# Altium schematic sheet microcontroller_board2.SchDoc
size 580 x 341 mm; SheetNumber: 2; SheetTotal: 2
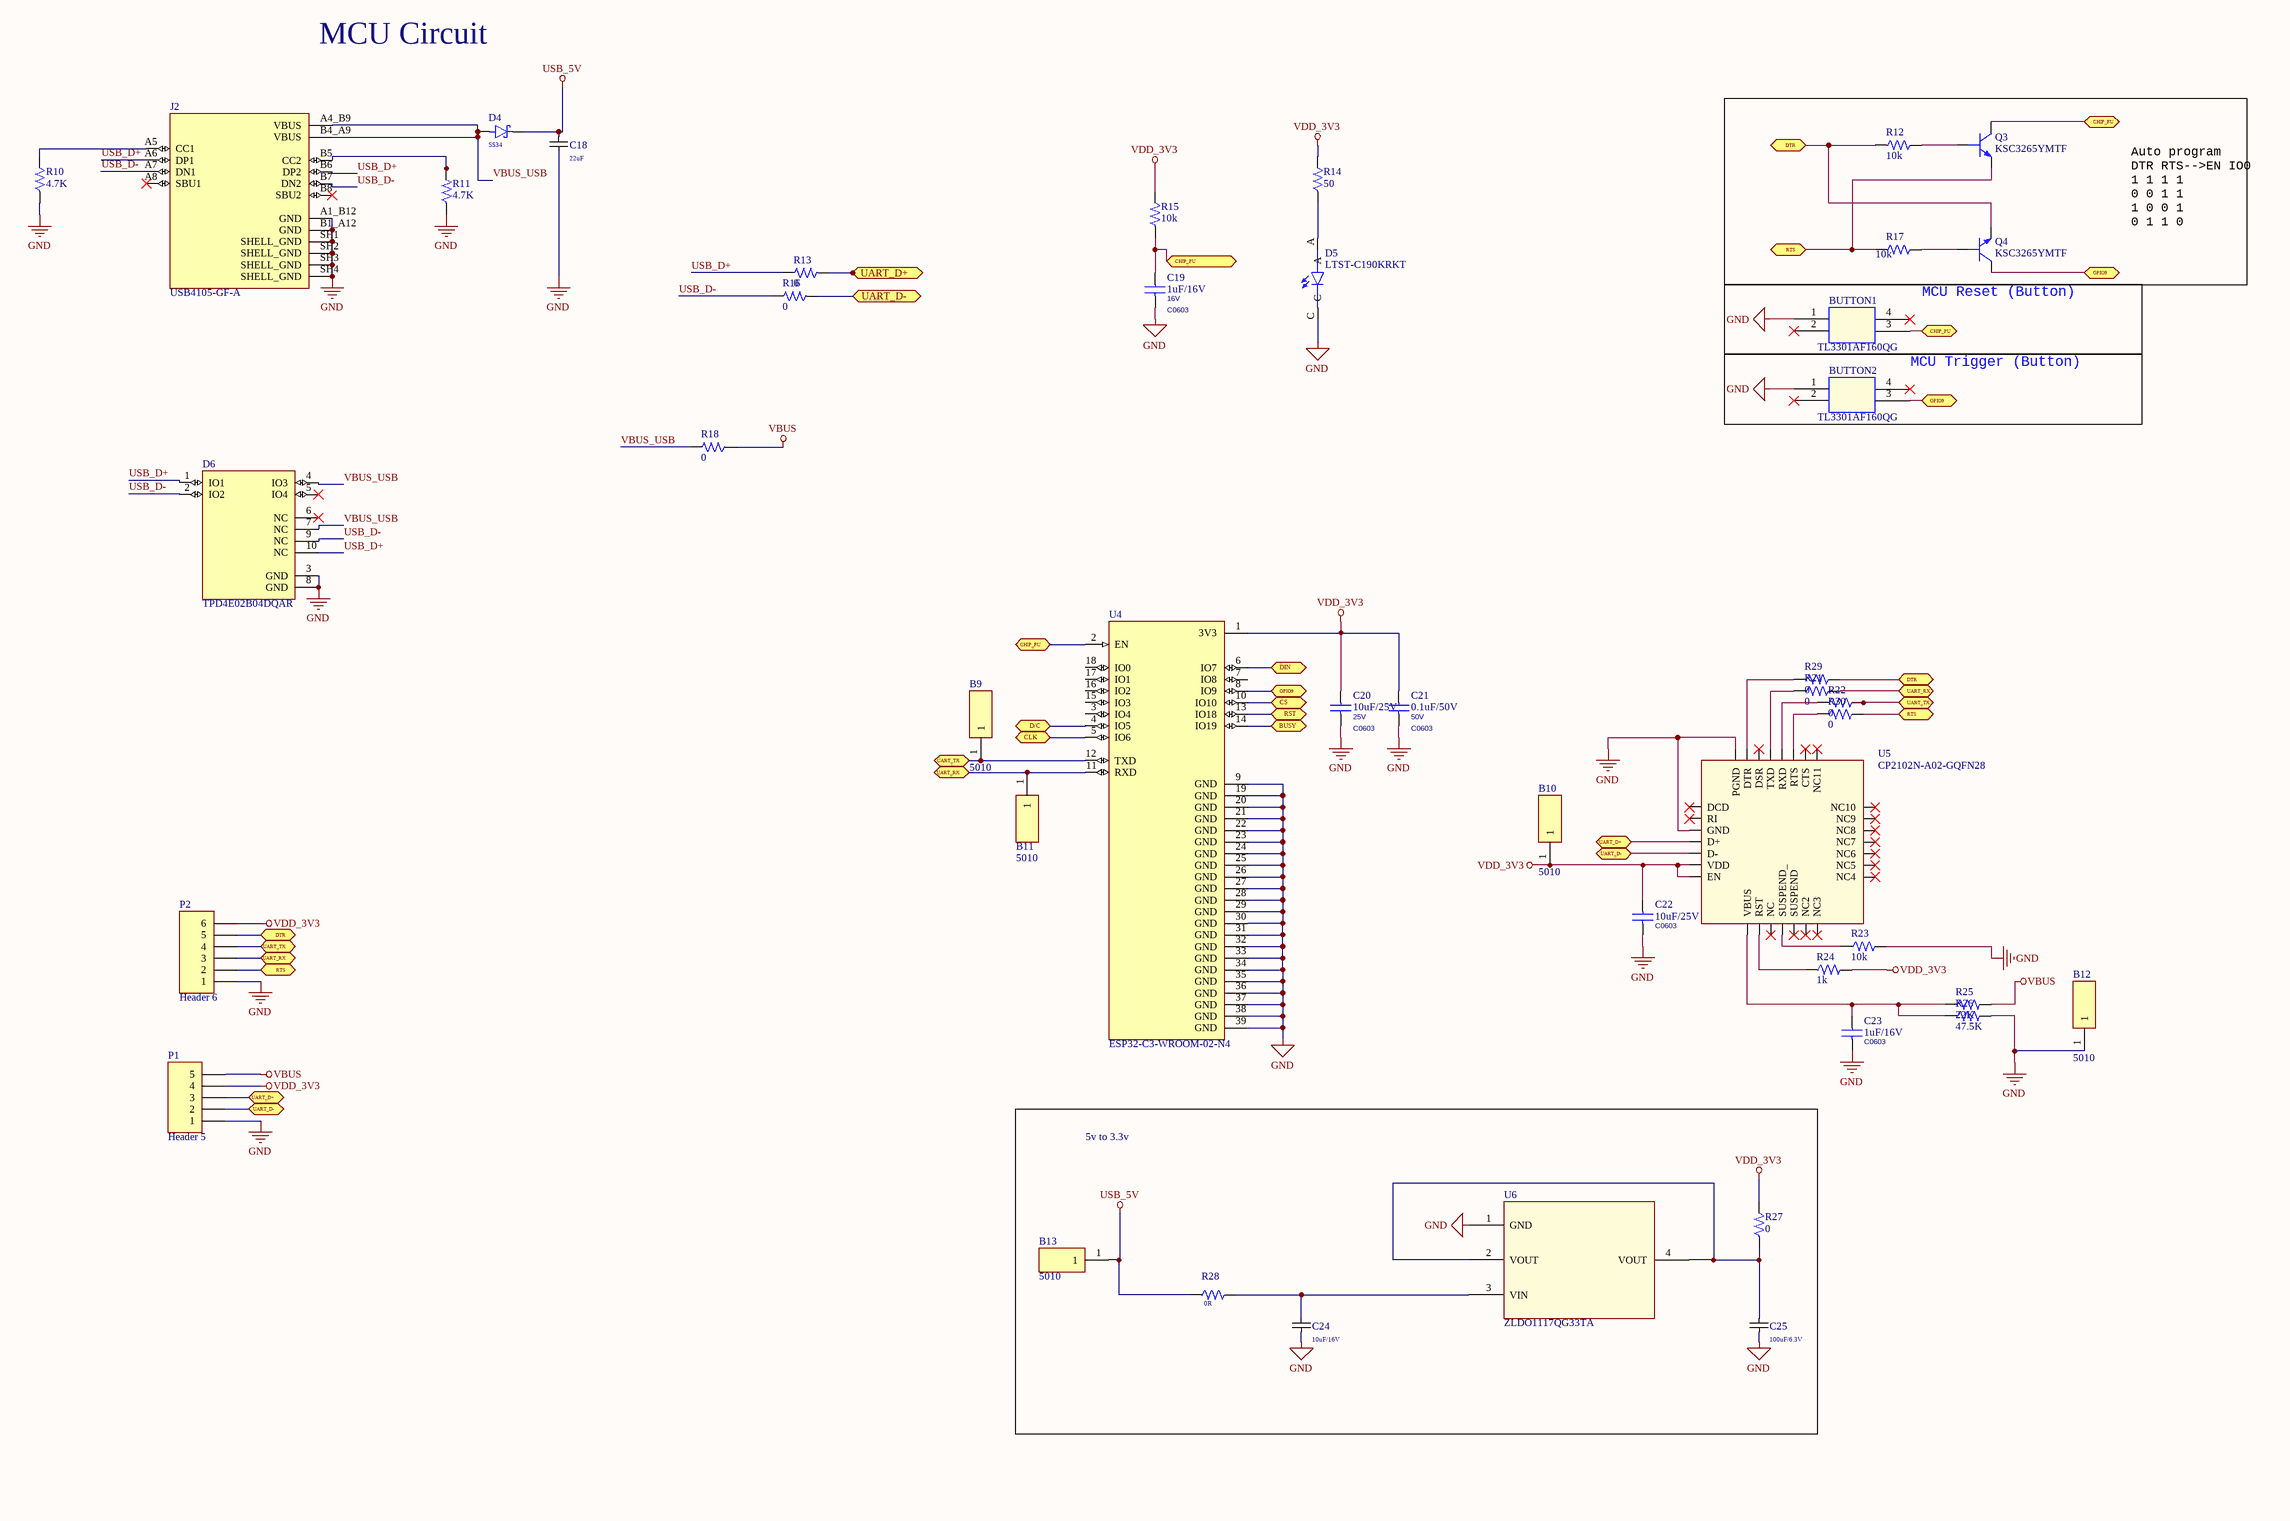
[diagram p0: microcontroller_board2.SchDoc]

## Parts
B9  5010  [5010]
B10  5010  [5010]
B11  5010  [5010]
B12  5010  [5010]
B13  5010  [5010]
BUTTON1  TL3301AF160QG  [TL3301AF160QG]
BUTTON2  TL3301AF160QG  [TL3301AF160QG]
C18  22uF  [Cap_0805]
C19  1uF/16V  PCB Footprint: C0603  Voltage: 16V  [Cap_0603]
C20  10uF/25V  Voltage: 25V  PCB Footprint: C0603  [Cap_0603]
C21  0.1uF/50V  Voltage: 50V  PCB Footprint: C0603  [Cap_0603]
C22  10uF/25V  PCB Footprint: C0603  [Cap_0603]
C23  1uF/16V  PCB Footprint: C0603  [Cap_0603]
C24  10uF/16V  [Cap_0603]
C25  100uF/6.3V  [Cap_0805]
D4  SS34  [DIOM7959X265N]
D5  LTST-C190KRKT  [LEDM1608X80]
D6  TPD4E02B04DQAR  [DIO_TPD4E02B04DQAR]
J2  USB4105-GF-A  [GCT_USB4105-GF-A]
P1  Header 5  [HDR1X5]
P2  Header 6  [HDR1X6]
Q3  KSC3265YMTF  [KSC3265YMTF]
Q4  KSC3265YMTF  [KSC3265YMTF]
R10  4.7K  [RES_0603]
R11  4.7K  [RES_0603]
R12  10k  [RES_0603]
R13  0  [RES_0603]
R14  50  [RES_0603]
R15  10k  [RES_0603]
R16  0  [RES_0603]
R17  10k  [RES_0603]
R18  0  [RES_0603]
R21  0  [RES_0603]
R22  0  [RES_0603]
R23  10k  [RES_0603]
R24  1k  [RES_0603]
R25  22K  [RES_0603]
R26  47.5K  [RES_0603]
R27  0  [RES_0603]
R28  0R  [RES_0805]
R29  0  [RES_0603]
R30  0  [RES_0603]
U4  ESP32-C3-WROOM-02-N4  [MODULE_ESP32-C3-WROOM-02-H4]
U5  CP2102N-A02-GQFN28  [CP2102N-A02-GQFN28]
U6  ZLDO1117QG33TA  [ZLDO1117QG33TA]

## Blocks framed on the sheet
MCU Reset (Button): BUTTON1
MCU Trigger (Button): BUTTON2
5v to 3.3v: B13 C24 C25 R27 R28 U6

## Ports
BUSY (bidir), CHIP_PU (bidir), CLK (bidir), CS (bidir), D/C (bidir), DIN (bidir), DTR (bidir), GPIO9 (bidir), RST (bidir), RTS (bidir), UART_D+ (bidir), UART_D- (bidir), UART_RX (bidir), UART_TX (bidir)

## Nets
GND: B12.1 BUTTON1.1(+) BUTTON2.1(+) C18.1 C19.2 C20.2 C21.2 C22.2 C23.2 C24.1 C25.1 D5.C D6.3(GND) D6.8(GND) J2.A1_B12(GND) J2.B1_A12(GND) J2.SH1(SHELL_GND) J2.SH2(SHELL_GND) J2.SH3(SHELL_GND) J2.SH4(SHELL_GND) P1.1 P2.1 R10.1 R11.1 R23.2 R26.2 U4.9(GND) U4.19(GND) U4.20(GND) U4.21(GND) U4.22(GND) U4.23(GND) U4.24(GND) U4.25(GND) U4.26(GND) U4.27(GND) U4.28(GND) U4.29(GND) U4.30(GND) U4.31(GND) U4.32(GND) U4.33(GND) U4.34(GND) U4.35(GND) U4.36(GND) U4.37(GND) U4.38(GND) U4.39(GND) U5.3(GND) U5.29(PGND) U6.1(GND)
USB_5V: B13.1 C18.2 D4.C(K) R28.1
VBUS: P1.5 R18.1 R25.2
VDD_3V3: B10.1 C20.1 C21.1 C22.1 P1.4 P2.6 R14.2 R15.2 R24.2 R27.2 U4.1(3V3) U5.6(VDD) U5.7(EN)
BUSY: U4.14(IO19) ; port BUSY
CHIP_PU: BUTTON1.3(+) C19.1 Q3.3(C) R15.1 U4.2(EN) ; port CHIP_PU
CLK: U4.5(IO6) ; port CLK
CS: U4.10(IO10) ; port CS
D/C: U4.4(IO5) ; port D/C
DIN: U4.6(IO7) ; port DIN
DTR: P2.5 Q4.2(E) R12.1 R29.2 ; port DTR
GPIO9: BUTTON2.3(+) Q4.3(C) U4.8(IO9) ; port GPIO9
RST: U4.13(IO18) ; port RST
RTS: P2.2 Q3.2(E) R17.1 R30.2 ; port RTS
UART_D+: P1.3 R13.1 U5.4(D+) ; port UART_D+
UART_D-: P1.2 R16.1 U5.5(D-) ; port UART_D-
UART_RX: B11.1 P2.3 R21.2 U4.11(RXD) ; port UART_RX
UART_TX: B9.1 P2.4 R22.2 U4.12(TXD) ; port UART_TX
USB_D+: D6.1(IO1) D6.10(NC) J2.A6(DP1) J2.B6(DP2) R13.2
USB_D-: D6.2(IO2) D6.9(NC) J2.A7(DN1) J2.B7(DN2) R16.2
VBUS_USB: D4.A D6.4(IO3) D6.7(NC) J2.A4_B9(VBUS) J2.B4_A9(VBUS) R18.2
NetC23_1: C23.1 R25.1 R26.1 U5.8(VBUS)
NetC24_2: C24.2 R28.2 U6.3(VIN)
NetC25_2: C25.2 R27.1 U6.2(VOUT) U6.4(VOUT)
NetD5_A: D5.A R14.1
NetJ2_A5: J2.A5(CC1) R10.2
NetJ2_B5: J2.B5(CC2) R11.2
NetQ3_1: Q3.1(B) R12.2
NetQ4_1: Q4.1(B) R17.2
NetR21_1: R21.1 U5.26(TXD)
NetR22_1: R22.1 U5.25(RXD)
NetR23_1: R23.1 U5.11(SUSPEND_)
NetR24_1: R24.1 U5.9(RST)
NetR29_1: R29.1 U5.28(DTR)
NetR30_1: R30.1 U5.24(RTS)

Not connected (* = marked no-connect by the designer): BUTTON1 2(+)* 4(+)*; BUTTON2 2(+)* 4(+)*; D6 5(IO4)* 6(NC)*; J2 A8(SBU1)* B8(SBU2)*; U4 3(IO4) 7(IO8) 15(IO3) 16(IO2) 17(IO1) 18(IO0); U5 1(DCD)* 2(RI)* 10(NC)* 12(SUSPEND)* 13(NC2)* 14(NC3)* 15(NC4)* 16(NC5)* 17(NC6)* 18(NC7)* 19(NC8)* 20(NC9)* 21(NC10)* 22(NC11)* 23(CTS)* 27(DSR)*

## Notes on the sheet
- MCU Circuit
- Auto program
  DTR RTS-->EN IO0
  1 1 1 1
  0 0 1 1
  1 0 0 1
  0 1 1 0

## Library data of the parts
B9-B13 = 5010: KEYSTONE - 5010 - TEST POINT, PCB, THROUGH HOLE; Manufacturer_Name: Keystone Electronics; Geometry.Height: 8.28mm; Manufacturer_Part_Number: 5010; Mouser Part Number: 534-5010; Mouser Price/Stock: https://www.mouser.co.uk/ProductDetail/Keystone-Electronics/5010?qs=qOqV1E1P08SzD%252BWfk1wMXQ%3D%3D; Arrow Part Number: 5010; Arrow Price/Stock: https://www.arrow.com/en/products/5010/keystone-electronics?region=europe; Datasheet Link: http://www.farnell.com/datasheets/1703983.pdf; MP: 5010
BUTTON1 BUTTON2 = CON4AP_0: MP: TL3301AF160QG
C18 = CAP_0805: 810-C2012X5R1V226MAC; MP: C2012X5R1V226M125AC; Voltage Rating: *; Tolerance: *; Package Size: CAP_0805; Capacitance: *
C19 = CAP NP_Dup2: Part Number: NC_0102-1422C12; Part Name: NC_GRM155R71H104KE14D; Manufacturer: Murata; 0 LOAD CHECK 0: ¡´; Material Description: NC_CAP,ML,0.1uF,X7R,50V,0402,K%,MU,RoHS; EIAJ: C0402; Tolerance: ¡Ó10%; Characteristics: X7R; GeometryHeight: 0.55mm; MP: GRT188R71C105KE13D; Part Type: Capacitor; Distributor: ¹ñ´I; Distributor1: ·ç±¶; Distributor2: ¬ü©_
C20 = CAP NP_Dup2: Part Number: NC_0102-1422C12; Part Name: GRM188R61E106MA73J; Manufacturer: Murata; 0 LOAD CHECK 0: ¡´; Material Description: NC_CAP,ML,0.1uF,X7R,50V,0402,K%,MU,RoHS; EIAJ: C0402; Tolerance: ¡Ó10%; Characteristics: X7R; GeometryHeight: 0.55mm; Part Type: Capacitor; Distributor: ¹ñ´I; Distributor1: ·ç±¶; Distributor2: ¬ü©_; MP: GRM188R61E106MA73J
C21 = CAP NP_Dup2: Part Number: NC_0102-1422C12; Part Name: NC_GRM155R71H104KE14D; Manufacturer: Murata; 0 LOAD CHECK 0: ¡´; Material Description: NC_CAP,ML,0.1uF,X7R,50V,0402,K%,MU,RoHS; EIAJ: C0402; Tolerance: ¡Ó10%; Characteristics: X7R; GeometryHeight: 0.55mm; MP: GCM188R71H104KA57J; Part Type: Capacitor; Distributor: ¹ñ´I; Distributor1: ·ç±¶; Distributor2: ¬ü©_
C22 = CAP NP_Dup2: GRM188R61E106MA73J; Manufacturer: Murata; Part Name: NC_GRM155R71H104KE14D; Part Number: NC_0102-1422C12; GeometryHeight: 0.55mm; Characteristics: X7R; Voltage: 16V; Tolerance: ¡Ó10%; EIAJ: C0402; Material Description: NC_CAP,ML,0.1uF,X7R,50V,0402,K%,MU,RoHS; 0 LOAD CHECK 0: ¡´; Distributor2: ¬ü©_; Distributor1: ·ç±¶; Distributor: ¹ñ´I; Part Type: Capacitor; MP: GRM188R61E106MA73J
C23 = CAP NP_Dup2: GRT188R71C105KE13D; Manufacturer: Murata; Part Name: NC_GRM155R71H104KE14D; Part Number: NC_0102-1422C12; GeometryHeight: 0.55mm; Characteristics: X7R; Voltage: 16V; Tolerance: ¡Ó10%; EIAJ: C0402; Material Description: NC_CAP,ML,0.1uF,X7R,50V,0402,K%,MU,RoHS; 0 LOAD CHECK 0: ¡´; Distributor2: ¬ü©_; Distributor1: ·ç±¶; Distributor: ¹ñ´I; Part Type: Capacitor; MP: GRT188R71C105KE13D
C24 = CAP_0603: C54; MP: GRM188R61C106MAALD; Voltage Rating: *; Tolerance: *; Package Size: CAP_0603
C25 = CAP_0805: GRM21BR60J107ME15K; Voltage Rating: *; Tolerance: *; Package Size: CAP_0805; Capacitance: *; MP: GRM21BR60J107ME15K
D4 = SS34: Diode Schottky 40 V 3A Surface Mount SMC (DO-214AB); MF: onsemi; SnapEDA_Link: https://www.snapeda.com/parts/SS34/Onsemi/view-part/?ref=snap; Package: SMC-2 ON Semiconductor; Value: *; MP: SS34; Check_prices: https://www.snapeda.com/parts/SS34/Onsemi/view-part/?ref=eda; Parameter 1: *
D5 = HSMS-C190: Red 626nm LED Indication - Discrete 2.1V 0603 _1608 Metric_; MF: Broadcom Limited; MP: LTST-C190KRKT; Value: *; Package: 0603 Broadcom; Price: None; Availability: Unavailable; SnapEDA_Link: https://www.snapeda.com/parts/HSMS-C190/Broadcom%20Limited/view-part/1781258/?ref=snap; Parameter 1: *
D6 = TPD4E02B04DQAR: 4-channel ESD protection diode for USB Type-C and HDMI 2.0 10-USON -40 to 125; MF: Texas Instruments; Value: *; MP: TPD4E02B04DQAR; Package: USON-10 Texas Instruments; Purchase-URL: https://pricing.snapeda.com/search/part/TPD4E02B04DQAR/?ref=eda; SnapEDA_Link: https://www.snapeda.com/parts/TPD4E02B04DQAR/Texas%20Instruments/view-part/576424/?ref=snap; Check_prices: https://www.snapeda.com/parts/TPD4E02B04DQAR/Texas%20Instruments/view-part/576424/?ref=eda; Digi-Key_Part_Number: 296-43875-1-ND; Parameter 1: *
J2 = USB4105-GF-A: USB-C (USB TYPE-C) USB 2.0 Receptacle Connector 24 (16+8 Dummy) Position Surface Mount, Right Angle; Through Hole; MF: GCT; SnapEDA_Link: https://www.snapeda.com/parts/USB4105-GF-A/Global+Connector+Technology/view-part/?ref=snap; Package: None; Value: *; MP: USB4105-GF-A; Check_prices: https://www.snapeda.com/parts/USB4105-GF-A/Global+Connector+Technology/view-part/?ref=eda; Parameter 1: *
P1 = Header 5: Header, 5-Pin; LatestRevisionDate: 17-Jul-2002; LatestRevisionNote: Re-released for DXP Platform.; Publisher: Altium Limited; Parameter 1: *
P2 = Header 6: Header, 6-Pin; LatestRevisionDate: 17-Jul-2002; LatestRevisionNote: Re-released for DXP Platform.; Publisher: Altium Limited; Parameter 1: *
Q3 Q4 = KSC3265YMTF: Bipolar Transistors - BJT NPN Epitaxial Transistor; MP: KSC3265YMTF
R10-R12 R15 R17 R21-R26 R29 R30 = RES_0603: Power Rating: *; Tolerance: *; Package Size: *
R13 R16 R18 R27 = RES_0603: MP: AC0603FR-070RL; Power Rating: *; Tolerance: *; Package Size: *
R14 = RES_0603: MP: RT0603BRE0750RL; Power Rating: *; Tolerance: *; Package Size: *
R28 = RES_0805: RC0805JR-070RL; Power Rating: *; Tolerance: *; Package Size: RES_0805; MP: RC0805JR-070RL
U4 = ESP32-C3-WROOM-02-N4: WiFi Modules (802.11) (Engineering Samples) SMD module, ESP32-C3, 4MB SPI flash, PCB antenna, -40 C +85 C; MF: Espressif Systems; Value: *; SnapEDA_Link: https://www.snapeda.com/parts/ESP32-C3-WROOM-02-N4/Espressif+Systems/view-part/?ref=snap; Purchase-URL: https://pricing.snapeda.com/search/part/ESP32-C3-WROOM-02-N4/?ref=eda; Availability: In Stock; Price: None; Package: Package; Check_prices: https://www.snapeda.com/parts/ESP32-C3-WROOM-02-N4/Espressif+Systems/view-part/?ref=eda; MP: ESP32-C3-WROOM-02-N4; Parameter 1: *
U5 = CP2102N-A02-GQFN28: USB Interface IC USBXpress - USB to UART Bridge; MP: CP2102N-A02-GQFN28
U6 = ZLDO1117QG33TA: A low dropout, high speed, positive adjustable or fixed-mode (3.3V) / regulator with 1A output current capability.; MP: ZLDO1117QG33TA